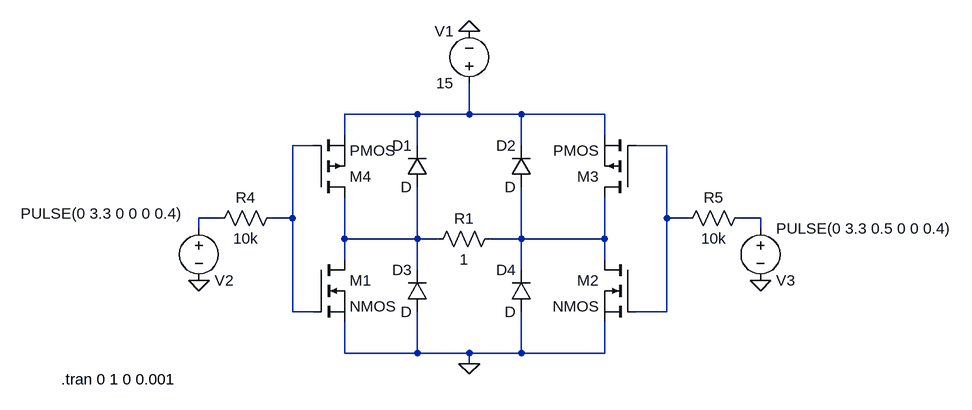
[diagram p0: schematic Draft1.asc]
Draft1.asc, the LTspice schematic file:
Version 4
SHEET 1 1032 680
WIRE 192 48 80 48
WIRE 272 48 272 0
WIRE 272 48 192 48
WIRE 352 48 272 48
WIRE 480 48 352 48
WIRE 80 80 80 48
WIRE 480 80 480 48
WIRE 32 96 0 96
WIRE 192 96 192 48
WIRE 352 96 352 48
WIRE 576 96 528 96
WIRE -112 208 -144 208
WIRE 0 208 0 96
WIRE 0 208 -32 208
WIRE 576 208 576 96
WIRE 608 208 576 208
WIRE 720 208 688 208
WIRE -144 224 -144 208
WIRE 720 224 720 208
WIRE 80 240 80 176
WIRE 192 240 192 160
WIRE 192 240 80 240
WIRE 224 240 192 240
WIRE 352 240 352 160
WIRE 352 240 304 240
WIRE 480 240 480 176
WIRE 480 240 352 240
WIRE 80 272 80 240
WIRE 480 272 480 240
WIRE 192 288 192 240
WIRE 352 288 352 240
WIRE 0 352 0 208
WIRE 32 352 0 352
WIRE 576 352 576 208
WIRE 576 352 528 352
WIRE 80 416 80 368
WIRE 192 416 192 352
WIRE 192 416 80 416
WIRE 272 416 192 416
WIRE 352 416 352 352
WIRE 352 416 272 416
WIRE 480 416 480 368
WIRE 480 416 352 416
WIRE 272 432 272 416
FLAG 272 -80 0
FLAG 272 432 0
FLAG 720 304 0
FLAG -144 304 0
SYMBOL nmos 32 272 R0
SYMATTR InstName M1
SYMBOL nmos 528 272 M0
SYMATTR InstName M2
SYMBOL pmos 528 176 R180
SYMATTR InstName M3
SYMBOL pmos 32 176 M180
SYMATTR InstName M4
SYMBOL res 320 224 R90
WINDOW 0 0 56 VBottom 2
WINDOW 3 32 56 VTop 2
SYMATTR InstName R1
SYMATTR Value 1
SYMBOL voltage 272 16 R180
WINDOW 0 24 96 Left 2
WINDOW 3 24 16 Left 2
WINDOW 123 0 0 Left 0
WINDOW 39 0 0 Left 0
SYMATTR InstName V1
SYMATTR Value 15
SYMBOL voltage -144 208 R0
WINDOW 0 24 96 Left 2
WINDOW 3 -274 -7 Left 2
WINDOW 123 0 0 Left 0
WINDOW 39 0 0 Left 0
SYMATTR InstName V2
SYMATTR Value PULSE(0 3.3 0 0 0 0.4)
SYMBOL voltage 720 208 R0
WINDOW 0 24 96 Left 2
WINDOW 3 24 16 Left 2
WINDOW 123 0 0 Left 0
WINDOW 39 0 0 Left 0
SYMATTR InstName V3
SYMATTR Value PULSE(0 3.3 0.5 0 0 0.4)
SYMBOL res -16 192 R90
WINDOW 0 0 56 VBottom 2
WINDOW 3 32 56 VTop 2
SYMATTR InstName R4
SYMATTR Value 10k
SYMBOL res 704 192 R90
WINDOW 0 0 56 VBottom 2
WINDOW 3 32 56 VTop 2
SYMATTR InstName R5
SYMATTR Value 10k
SYMBOL diode 208 160 R180
WINDOW 0 24 64 Left 2
WINDOW 3 24 0 Left 2
SYMATTR InstName D1
SYMBOL diode 368 160 R180
WINDOW 0 24 64 Left 2
WINDOW 3 24 0 Left 2
SYMATTR InstName D2
SYMBOL diode 208 352 R180
WINDOW 0 24 64 Left 2
WINDOW 3 24 0 Left 2
SYMATTR InstName D3
SYMBOL diode 368 352 R180
WINDOW 0 24 64 Left 2
WINDOW 3 24 0 Left 2
SYMATTR InstName D4
TEXT -356 456 Left 2 !.tran 0 1 0 0.001

The netlist it stands for:
* Draft1.asc
M1 N006 N002 0 0 NMOS
M2 N007 N003 0 0 NMOS
M3 N007 N003 N001 N001 PMOS
M4 N006 N002 N001 N001 PMOS
R1 N007 N006 1
V1 N001 0 15
V2 N004 0 PULSE(0 3.3 0 0 0 0.4)
V3 N005 0 PULSE(0 3.3 0.5 0 0 0.4)
R4 N002 N004 10k
R5 N005 N003 10k
D1 N006 N001 D
D2 N007 N001 D
D3 0 N006 D
D4 0 N007 D
.model D D
.lib standard.dio
.model NMOS NMOS
.model PMOS PMOS
.lib standard.mos
.tran 0 1 0 0.001
.backanno
.end